# Altium schematic sheet FPGA_Power.SchDoc
size A
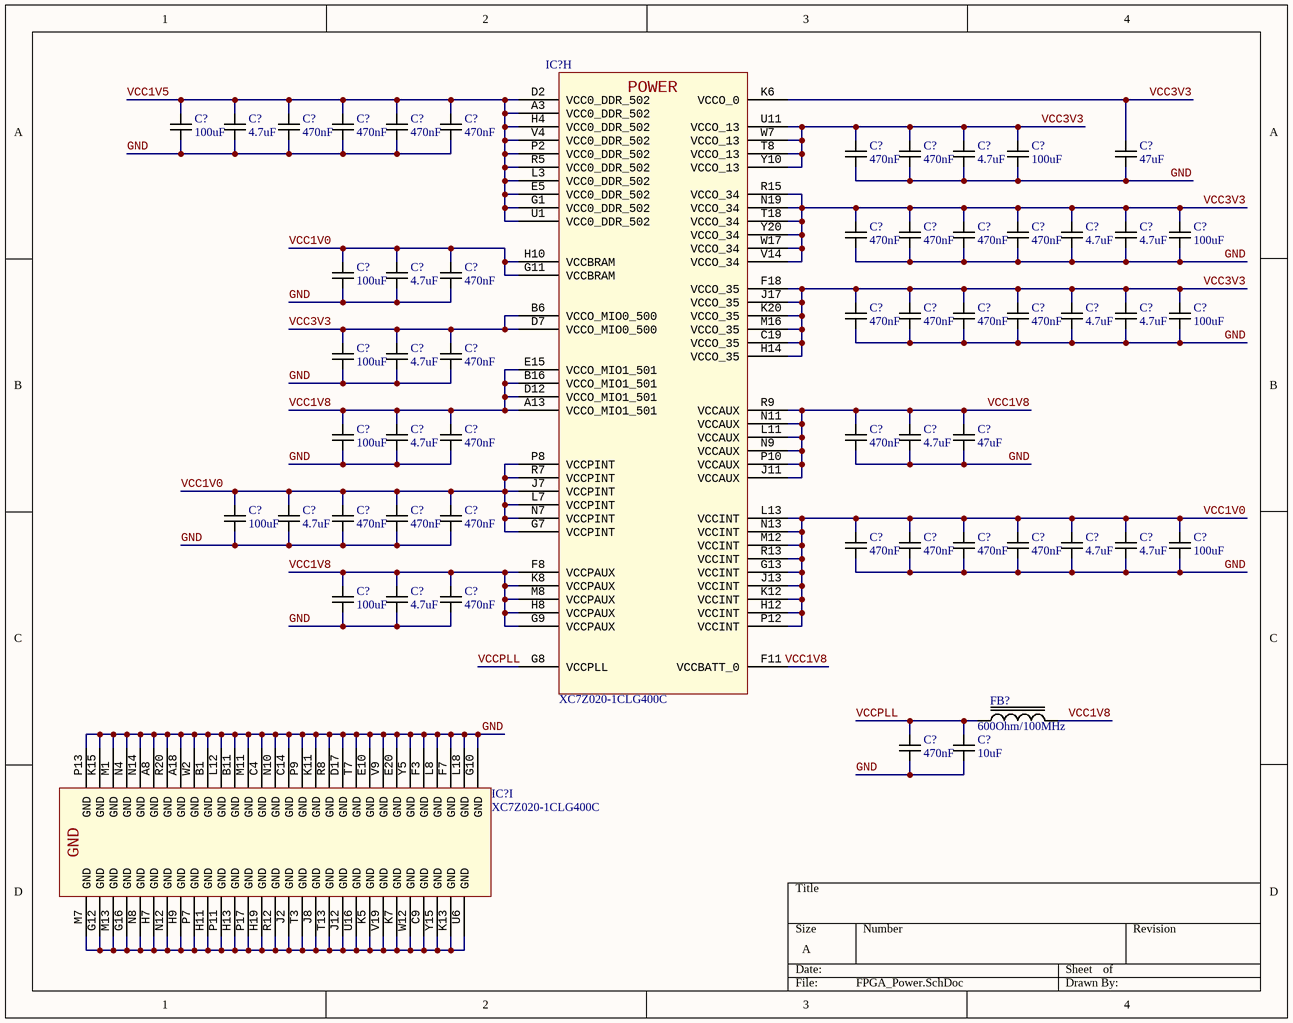
[diagram p0: FPGA_Power.SchDoc]

## Parts
(Parts that share a designator on the sheet are numbered #1, #2 ... from top to bottom, then left to right.)
C?#1  100uF
C?#2  4.7uF  [CAP0805]
C?#3  470nF  [CAP0603]
C?#4  470nF  [CAP0603]
C?#5  470nF  [CAP0603]
C?#6  470nF  [CAP0603]
C?#7  470nF  [CAP0603]
C?#8  470nF  [CAP0603]
C?#9  4.7uF  [CAP0805]
C?#10  100uF
C?#11  47uF  [CAP1210]
C?#12  470nF  [CAP0603]
C?#13  470nF  [CAP0603]
C?#14  470nF  [CAP0603]
C?#15  470nF  [CAP0603]
C?#16  4.7uF  [CAP0805]
C?#17  4.7uF  [CAP0805]
C?#18  100uF
C?#19  100uF
C?#20  4.7uF  [CAP0805]
C?#21  470nF  [CAP0603]
C?#22  470nF  [CAP0603]
C?#23  470nF  [CAP0603]
C?#24  470nF  [CAP0603]
C?#25  470nF  [CAP0603]
C?#26  4.7uF  [CAP0805]
C?#27  4.7uF  [CAP0805]
C?#28  100uF
C?#29  100uF
C?#30  4.7uF  [CAP0805]
C?#31  470nF  [CAP0603]
C?#32  100uF
C?#33  4.7uF  [CAP0805]
C?#34  470nF  [CAP0603]
C?#35  470nF  [CAP0603]
C?#36  4.7uF  [CAP0805]
C?#37  47uF  [CAP1210]
C?#38  100uF
C?#39  4.7uF  [CAP0805]
C?#40  470nF  [CAP0603]
C?#41  470nF  [CAP0603]
C?#42  470nF  [CAP0603]
C?#43  470nF  [CAP0603]
C?#44  470nF  [CAP0603]
C?#45  470nF  [CAP0603]
C?#46  470nF  [CAP0603]
C?#47  4.7uF  [CAP0805]
C?#48  4.7uF  [CAP0805]
C?#49  100uF
C?#50  100uF
C?#51  4.7uF  [CAP0805]
C?#52  470nF  [CAP0603]
C?#53  470nF  [CAP0603]
C?#54  10uF  [CAP0805]
FB?  600Ohm/100MHz  [FB0805]
IC?#1  XC7Z020-1CLG400C  [BGA400]  (part H of 9)
IC?#2  XC7Z020-1CLG400C  [BGA400]  (part I of 9)

## Nets
GND: C?#1.?2 C?#2.2 C?#3.2 C?#4.2 C?#5.2 C?#6.2 C?#7.2 C?#8.2 C?#9.2 C?#10.?2 C?#11.2 C?#12.2 C?#13.2 C?#14.2 C?#15.2 C?#16.2 C?#17.2 C?#18.?2 C?#19.?2 C?#20.2 C?#21.2 C?#22.2 C?#23.2 C?#24.2 C?#25.2 C?#26.2 C?#27.2 C?#28.?2 C?#29.?2 C?#30.2 C?#31.2 C?#32.?2 C?#33.2 C?#34.2 C?#35.2 C?#36.2 C?#37.2 C?#38.?2 C?#39.2 C?#40.2 C?#41.2 C?#42.2 C?#43.2 C?#44.2 C?#45.2 C?#46.2 C?#47.2 C?#48.2 C?#49.?2 C?#50.?2 C?#51.2 C?#52.2 C?#53.2 C?#54.2 IC?#2.A8(GND) IC?#2.A18(GND) IC?#2.B1(GND) IC?#2.B11(GND) IC?#2.C4(GND) IC?#2.C14(GND) IC?#2.D17(GND) IC?#2.E10(GND) IC?#2.E20(GND) IC?#2.F3(GND) IC?#2.F7(GND) IC?#2.G10(GND) IC?#2.K11(GND) IC?#2.K15(GND) IC?#2.L8(GND) IC?#2.L12(GND) IC?#2.L18(GND) IC?#2.M1(GND) IC?#2.M11(GND) IC?#2.N4(GND) IC?#2.N10(GND) IC?#2.N14(GND) IC?#2.P9(GND) IC?#2.P13(GND) IC?#2.R8(GND) IC?#2.R20(GND) IC?#2.T7(GND) IC?#2.V9(GND) IC?#2.W2(GND) IC?#2.Y5(GND)
VCC1V0: C?#19.?1 C?#20.1 C?#21.1 C?#38.?1 C?#39.1 C?#40.1 C?#41.1 C?#42.1 C?#43.1 C?#44.1 C?#45.1 C?#46.1 C?#47.1 C?#48.1 C?#49.?1 IC?#1.G7(VCCPINT) IC?#1.G11(VCCBRAM) IC?#1.G13(VCCINT) IC?#1.H10(VCCBRAM) IC?#1.H12(VCCINT) IC?#1.J7(VCCPINT) IC?#1.J13(VCCINT) IC?#1.K12(VCCINT) IC?#1.L7(VCCPINT) IC?#1.L13(VCCINT) IC?#1.M12(VCCINT) IC?#1.N7(VCCPINT) IC?#1.N13(VCCINT) IC?#1.P8(VCCPINT) IC?#1.P12(VCCINT) IC?#1.R7(VCCPINT) IC?#1.R13(VCCINT)
VCC1V5: C?#1.?1 C?#2.1 C?#3.1 C?#4.1 C?#5.1 C?#6.1 IC?#1.A3(VCC0_DDR_502) IC?#1.D2(VCC0_DDR_502) IC?#1.E5(VCC0_DDR_502) IC?#1.G1(VCC0_DDR_502) IC?#1.H4(VCC0_DDR_502) IC?#1.L3(VCC0_DDR_502) IC?#1.P2(VCC0_DDR_502) IC?#1.R5(VCC0_DDR_502) IC?#1.U1(VCC0_DDR_502) IC?#1.V4(VCC0_DDR_502)
VCC1V8: C?#32.?1 C?#33.1 C?#34.1 C?#35.1 C?#36.1 C?#37.1 C?#50.?1 C?#51.1 C?#52.1 FB?.2 IC?#1.A13(VCCO_MIO1_501) IC?#1.B16(VCCO_MIO1_501) IC?#1.D12(VCCO_MIO1_501) IC?#1.E15(VCCO_MIO1_501) IC?#1.F8(VCCPAUX) IC?#1.F11(VCCBATT_0) IC?#1.G9(VCCPAUX) IC?#1.H8(VCCPAUX) IC?#1.J11(VCCAUX) IC?#1.K8(VCCPAUX) IC?#1.L11(VCCAUX) IC?#1.M8(VCCPAUX) IC?#1.N9(VCCAUX) IC?#1.N11(VCCAUX) IC?#1.P10(VCCAUX) IC?#1.R9(VCCAUX)
VCC3V3: C?#7.1 C?#8.1 C?#9.1 C?#10.?1 C?#11.1 C?#12.1 C?#13.1 C?#14.1 C?#15.1 C?#16.1 C?#17.1 C?#18.?1 C?#22.1 C?#23.1 C?#24.1 C?#25.1 C?#26.1 C?#27.1 C?#28.?1 C?#29.?1 C?#30.1 C?#31.1 IC?#1.B6(VCCO_MIO0_500) IC?#1.C19(VCCO_35) IC?#1.D7(VCCO_MIO0_500) IC?#1.F18(VCCO_35) IC?#1.H14(VCCO_35) IC?#1.J17(VCCO_35) IC?#1.K6(VCCO_0) IC?#1.K20(VCCO_35) IC?#1.M16(VCCO_35) IC?#1.N19(VCCO_34) IC?#1.R15(VCCO_34) IC?#1.T8(VCCO_13) IC?#1.T18(VCCO_34) IC?#1.U11(VCCO_13) IC?#1.V14(VCCO_34) IC?#1.W7(VCCO_13) IC?#1.W17(VCCO_34) IC?#1.Y10(VCCO_13) IC?#1.Y20(VCCO_34)
VCCPLL: C?#53.1 C?#54.1 FB?.1 IC?#1.G8(VCCPLL)
NetIC?#2_C9: IC?#2.C9(GND) IC?#2.G12(GND) IC?#2.G16(GND) IC?#2.H7(GND) IC?#2.H9(GND) IC?#2.H11(GND) IC?#2.H13(GND) IC?#2.H19(GND) IC?#2.J2(GND) IC?#2.J8(GND) IC?#2.J12(GND) IC?#2.K5(GND) IC?#2.K7(GND) IC?#2.K13(GND) IC?#2.M7(GND) IC?#2.M13(GND) IC?#2.N8(GND) IC?#2.N12(GND) IC?#2.P7(GND) IC?#2.P11(GND) IC?#2.P17(GND) IC?#2.R12(GND) IC?#2.T3(GND) IC?#2.T13(GND) IC?#2.U6(GND) IC?#2.U16(GND) IC?#2.V19(GND) IC?#2.W12(GND) IC?#2.Y15(GND)

## Notes on the sheet
- (in symbol XC7Z020-1CLG400C, part H) POWER

## Library data of the parts
C?#1 C?#10 C?#18 C?#19 C?#28 C?#29 C?#32 C?#38 C?#49 C?#50 = 100uF: MLCC 100uF 1210 SMD; Manufacturer: Murata; Manufacturer Part Number: GRM32EE70G107ME19L; Material: Ceramic; Tolerance: 20%; Voltage Rating (DC): 4V; Dielectric: X7U; Supplier 1: Digi-Key; Stock 1: 18905; Pricing 1: 1=1.27000, 10=1.00100, 100=0.75060, 500=0.56716 (USD); RoHS: Yes; Mount: Surface Mount; Case/Package: 1210; Number of Pins: 2; Case Code (Imperial): 1210; Case Code (Metric): 3225; Min Operating Temperature: -55°C; Max Operating Temperature: 125°C; Capacitance: 100uF; Packaging: Tape and Reel; Termination: SMD/SMT; Voltage Rating: 4V; Package Quantity: 1; Length: 3.2mm; Height: 2.5mm; Width: 2.5mm; Thickness: 0.106inch; Depth: 2.5mm; Lead Pitch: 1mm; Radiation Hardening: No; REACH SVHC: No SVHC; Lead Free: Lead Free; ComponentLink1URL: https://datasheet.ciiva.com/5422/product-5422439.pdf?src-supplier=Mouser; ComponentLink1Description: https://datasheet.ciiva.com/5422/product-5422439.pdf?src-supplier=Mouser; ComponentLink2URL: https://datasheet.ciiva.com/6264/partnumbering-e-01-6264538.pdf?src-supplier=Digi-Key; ComponentLink2Description: https://datasheet.ciiva.com/6264/partnumbering-e-01-6264538.pdf?src-supplier=Digi-Key; ComponentLink3URL: https://datasheet.ciiva.com/7719/1303574-7719178.pdf?src-supplier=Element14; ComponentLink3Description: https://datasheet.ciiva.com/7719/1303574-7719178.pdf?src-supplier=Element14; ComponentLink4URL: https://datasheet.ciiva.com/6264/partnumbering-e-01-6264539.pdf?src-supplier=Digi-Key; ComponentLink4Description: https://datasheet.ciiva.com/6264/partnumbering-e-01-6264539.pdf?src-supplier=Digi-Key; ComponentLink5URL: https://datasheet.ciiva.com/14116/grmseries-highdielectrictype-eng-14116427.pdf?src-supplier=Distrelec; ComponentLink5Description: https://datasheet.ciiva.com/14116/grmseries-highdielectrictype-eng-14116427.pdf?src-supplier=Distrelec; ComponentLink6URL: https://datasheet.ciiva.com/6264/partnumbering-e-01-6264540.pdf?src-supplier=Digi-Key; ComponentLink6Description: https://datasheet.ciiva.com/6264/partnumbering-e-01-6264540.pdf?src-supplier=Digi-Key; ComponentLink7URL: https://datasheet.ciiva.com/11605/product-11605486.pdf?src-supplier=Avnet; ComponentLink7Description: https://datasheet.ciiva.com/11605/product-11605486.pdf?src-supplier=Avnet
C?#2 C?#9 C?#16 C?#17 C?#20 C?#26 C?#27 C?#30 C?#33 C?#36 C?#39 C?#47 C?#48 C?#51 = C2012X7R1A475K085AC: MLCC 4.7uF 0805 SMD; Manufacturer: TDK; Dielectric Material: Ceramic; Tolerance: 10%; Voltage Rating: 10V; Dielectric: X7R; Supplier 1: Digi-Key; Manufacturer Part Number: C2012X7R1A475K085AC; Stock 1: 87407; Pricing 1: 1=0.22000, 10=0.15200, 100=0.08600, 500=0.06072, 1000=0.05313 (USD); RoHS: Yes; Mount: Surface Mount; Case/Package: 0805; Case Code (Metric): 2012; Case Code (Imperial): 0805; Min Operating Temperature: -55°C; Max Operating Temperature: 125°C; Package Quantity: 4000; Packaging: Cut Tape; Capacitance: 4.7uF; Voltage Rating (DC): 10V; Length: 0.079inch; Width: 0.049inch; Thickness: 0.039inch; REACH SVHC: No SVHC; Lead Free: Lead Free; ComponentLink1URL: https://datasheet.ciiva.com/14886/tdkmlcccaprange-14886121.pdf?src-supplier=Digi-Key; ComponentLink1Description: https://datasheet.ciiva.com/14886/tdkmlcccaprange-14886121.pdf?src-supplier=Digi-Key; ComponentLink2URL: https://product.tdk.com/info/en/catalog/datasheets/mlcc_commercial_general_en.pdf; ComponentLink2Description: https://product.tdk.com/info/en/catalog/datasheets/mlcc_commercial_general_en.pdf
C?#3-C?#8 C?#12-C?#15 C?#21-C?#25 C?#31 C?#34 C?#35 C?#40-C?#46 C?#52 C?#53 = GRM188R70J474KA01D: MLCC 470nF 0603 SMD; pin to pad: 2>none; Manufacturer: Murata; Voltage Rating: 6.3V; Tolerance: 10%; Dielectric: X7R; Supplier 1: Digi-Key; Manufacturer Part Number: GRM188R70J474KA01D; Stock 1: 92537; Pricing 1: 1=0.17000, 10=0.11700, 100=0.05940, 500=0.04066, 1000=0.03597 (USD); RoHS: Yes; Mount: Surface Mount; Case/Package: 0603; Case Code (Metric): 1608; Case Code (Imperial): 0603; Min Operating Temperature: -55°C; Max Operating Temperature: 125°C; Package Quantity: 4000; Capacitance: 470nF; Packaging: Tape and Reel; Voltage Rating (DC): 6.3V; Termination: SMD/SMT; Length: 1.6mm; Height: 0.8mm; Width: 0.031inch; Thickness: 0.035inch; Depth: 0.8mm; Radiation Hardening: No; Lead Free: Lead Free; ComponentLink1URL: https://datasheet.ciiva.com/6264/product-6264161.pdf?src-supplier=Digi-Key; ComponentLink1Description: https://datasheet.ciiva.com/6264/product-6264161.pdf?src-supplier=Digi-Key; ComponentLink2URL: https://datasheet.ciiva.com/11673/product-11673478.pdf?src-supplier=Avnet; ComponentLink2Description: https://datasheet.ciiva.com/11673/product-11673478.pdf?src-supplier=Avnet; ComponentLink3URL: https://datasheet.ciiva.com/6264/partnumbering-e-01-6264159.pdf?src-supplier=Digi-Key; ComponentLink3Description: https://datasheet.ciiva.com/6264/partnumbering-e-01-6264159.pdf?src-supplier=Digi-Key
C?#11 C?#37 = GRM32ER70J476ME20L: MLCC 47uF 1210 SMD; Manufacturer: Murata; Tolerance: 20%; Voltage Rating: 6.3V; Dielectric: X7R; Supplier 1: Digi-Key; Manufacturer Part Number: GRM32ER70J476ME20L; Stock 1: 32926; Pricing 1: 1=2.11000, 10=1.70900, 100=1.30480, 500=0.99416 (USD); RoHS: Yes; Mount: Surface Mount; Case/Package: 1210; Case Code (Metric): 3225; Case Code (Imperial): 1210; Min Operating Temperature: -55°C; Max Operating Temperature: 125°C; Package Quantity: 1; Packaging: Tape and Reel; Capacitance: 47uF; Voltage Rating (DC): 6.3V; Termination: SMD/SMT; Length: 3.2mm; Height: 2.5mm; Width: 0.098inch; Thickness: 0.106inch; Depth: 2.5mm; Radiation Hardening: No; Lead Free: Lead Free; ComponentLink1URL: https://datasheet.ciiva.com/6264/partnumbering-e-01-6264582.pdf?src-supplier=Digi-Key; ComponentLink1Description: https://datasheet.ciiva.com/6264/partnumbering-e-01-6264582.pdf?src-supplier=Digi-Key; ComponentLink2URL: https://datasheet.ciiva.com/6264/partnumbering-e-01-6264583.pdf?src-supplier=Digi-Key; ComponentLink2Description: https://datasheet.ciiva.com/6264/partnumbering-e-01-6264583.pdf?src-supplier=Digi-Key; ComponentLink3URL: https://datasheet.ciiva.com/6264/partnumbering-e-01-6264585.pdf?src-supplier=Digi-Key; ComponentLink3Description: https://datasheet.ciiva.com/6264/partnumbering-e-01-6264585.pdf?src-supplier=Digi-Key; ComponentLink4URL: https://datasheet.ciiva.com/16497/product-16497003.pdf?src-supplier=Future+Electronics; ComponentLink4Description: https://datasheet.ciiva.com/16497/product-16497003.pdf?src-supplier=Future+Electronics
C?#54 = 08056D106KAT2A: MLCC 10uF 0805 SMD; Manufacturer: Kyocera AVX; Dielectric Material: Ceramic; Voltage Rating: 6.3V; Tolerance: 10%; Dielectric: X5R; Insulation Resistance: 500MR; Supplier 1: Digi-Key; Manufacturer Part Number: 08056D106KAT2A; Stock 1: 217962; Pricing 1: 1=0.50000, 10=0.35100, 100=0.23100, 500=0.17112, 1000=0.14545 (USD); RoHS: Yes; Mount: Surface Mount,PCB; Case/Package: 0805; Number of Pins: 2; Case Code (Imperial): 0805; Case Code (Metric): 2012; Min Operating Temperature: -55°C; Max Operating Temperature: 85°C; Capacitance: 10uF; Package Quantity: 1; Voltage Rating (DC): 6.3V; Packaging: Tape and Reel; Termination: SMD/SMT; Voltage: 6.3V; Length: 2.01mm; Height: 1.4mm; Width: 1.25mm; Thickness: 0.055inch; Depth: 1.25mm; Radiation Hardening: No; REACH SVHC: No SVHC; Lead Free: Lead Free; ComponentLink1URL: https://datasheet.ciiva.com/11788/0900766b80def1a5-11788549.pdf?src-supplier=RSComponents; ComponentLink1Description: https://datasheet.ciiva.com/11788/0900766b80def1a5-11788549.pdf?src-supplier=RSComponents; ComponentLink2URL: https://datasheet.ciiva.com/19467/2012662-19467718.pdf?src-supplier=Jameco; ComponentLink2Description: https://datasheet.ciiva.com/19467/2012662-19467718.pdf?src-supplier=Jameco; ComponentLink3URL: https://datasheet.ciiva.com/151/cx5r-151672.pdf?src-supplier=Digi-Key; ComponentLink3Description: https://datasheet.ciiva.com/151/cx5r-151672.pdf?src-supplier=Digi-Key; ComponentLink4URL: https://datasheet.ciiva.com/7812/26587-7812184.pdf?src-supplier=Element14; ComponentLink4Description: https://datasheet.ciiva.com/7812/26587-7812184.pdf?src-supplier=Element14; ComponentLink5URL: https://datasheet.ciiva.com/14598/70001028-14598616.pdf?src-supplier=Allied+Electronics; ComponentLink5Description: https://datasheet.ciiva.com/14598/70001028-14598616.pdf?src-supplier=Allied+Electronics; ComponentLink6URL: https://datasheet.ciiva.com/151/cx5r-151673.pdf?src-supplier=Digi-Key; ComponentLink6Description: https://datasheet.ciiva.com/151/cx5r-151673.pdf?src-supplier=Digi-Key; ComponentLink7URL: https://datasheet.ciiva.com/7812/26587-7812185.pdf?src-supplier=Element14; ComponentLink7Description: https://datasheet.ciiva.com/7812/26587-7812185.pdf?src-supplier=Element14; ComponentLink8URL: https://datasheet.ciiva.com/151/cx5r-151674.pdf?src-supplier=Digi-Key; ComponentLink8Description: https://datasheet.ciiva.com/151/cx5r-151674.pdf?src-supplier=Digi-Key; ComponentLink9URL: https://datasheet.ciiva.com/7812/1666675-7812186.pdf?src-supplier=Element14; ComponentLink9Description: https://datasheet.ciiva.com/7812/1666675-7812186.pdf?src-supplier=Element14; ComponentLink10URL: https://datasheet.ciiva.com/2988/cx5r-2988044.pdf?src-supplier=Avnet; ComponentLink10Description: https://datasheet.ciiva.com/2988/cx5r-2988044.pdf?src-supplier=Avnet; ComponentLink11URL: https://datasheet.ciiva.com/16392/cx5r-16392797.pdf?src-supplier=Future+Electronics; ComponentLink11Description: https://datasheet.ciiva.com/16392/cx5r-16392797.pdf?src-supplier=Future+Electronics; ComponentLink12URL: https://datasheet.ciiva.com/16544/cx5r-16544062.pdf?src-supplier=Avnet+Asia; ComponentLink12Description: https://datasheet.ciiva.com/16544/cx5r-16544062.pdf?src-supplier=Avnet+Asia
FB? = HZ0805E601R-10: Ferrite Bead 600Ohm/100MHz 0805 SMD; Manufacturer: Laird; Current Rating: 500mA; Impedance: 600R; Number of Lines: 1; DC Resistance (DCR): 300mR; Test Frequency: 100MHz; Supplier 1: Digi-Key; Manufacturer Part Number: HZ0805E601R-10; Stock 1: 4500868; Pricing 1: 1=0.10000, 10=0.04700, 25=0.04160, 50=0.03800, 100=0.03420, 250=0.02504, 500=0.01822, 1000=0.01784 (USD); RoHS: Yes; Mount: Surface Mount; Case/Package: 0805; Weight: 0.00392oz; Case Code (Metric): 2012; Case Code (Imperial): 0805; Material: Ferrite; Contact Plating: Tin,Matte; Core Material: Ferrite; Min Operating Temperature: -40°C; Max Operating Temperature: 125°C; Package Quantity: 1; Packaging: Tape and Reel; Max Current Rating: 500mA; Max DC Current: 500mA; Termination: SMD/SMT; Frequency: 100MHz; Length: 2mm; Height: 1.25mm; Width: 0.049inch; Depth: 1.45mm; REACH SVHC: Unknown; Lead Free: Lead Free; ComponentLink1URL: https://datasheet.ciiva.com/22622/1685710-22622833.pdf?src-supplier=Element14; ComponentLink1Description: https://datasheet.ciiva.com/22622/1685710-22622833.pdf?src-supplier=Element14; ComponentLink2URL: https://datasheet.ciiva.com/1013/hz0805e601r-10-1013170.pdf?src-supplier=Digi-Key; ComponentLink2Description: https://datasheet.ciiva.com/1013/hz0805e601r-10-1013170.pdf?src-supplier=Digi-Key; ComponentLink3URL: https://datasheet.ciiva.com/8512/hz0805e601r-10-a-vp-8512772.pdf?src-supplier=Avnet; ComponentLink3Description: https://datasheet.ciiva.com/8512/hz0805e601r-10-a-vp-8512772.pdf?src-supplier=Avnet; ComponentLink4URL: https://datasheet.ciiva.com/16714/70065439-16714006.pdf?src-supplier=Allied+Electronics; ComponentLink4Description: https://datasheet.ciiva.com/16714/70065439-16714006.pdf?src-supplier=Allied+Electronics
IC?#1 IC?#2 = XC7Z020-1CLG400C: Zynq-7000 SoC.; ComponentLink1Description: Digi-Key; ComponentLink1URL: https://www.digikey.com/product-detail/en/xilinx-inc/XC7Z020-1CLG400C/122-1851-ND/3925758?utm_adgroup=Integrated Circuits&slid=&gclid=Cj0KCQjwn_LrBRD4ARIsAFEQFKtYXIOPieaS_xsLL2AvFALkVw3M5siD0KQOWM0owpA_yiQuHKATBqcaAuQ6EALw_wcB